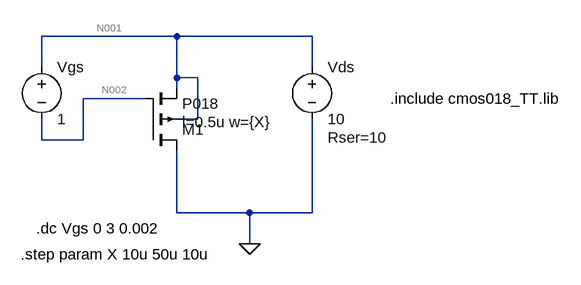
[diagram p0: schematic P018_Char.asc]
P018_Char.asc, the LTspice schematic file:
Version 4
SHEET 1 880 680
WIRE 208 80 0 80
WIRE 416 80 208 80
WIRE 0 128 0 80
WIRE 416 128 416 80
WIRE 208 144 208 80
WIRE 240 144 208 144
WIRE 208 160 208 144
WIRE 160 176 64 176
WIRE 240 208 240 144
WIRE 240 208 208 208
WIRE 0 240 0 208
WIRE 64 240 64 176
WIRE 64 240 0 240
WIRE 208 352 208 256
WIRE 320 352 208 352
WIRE 416 352 416 208
WIRE 416 352 320 352
WIRE 320 400 320 352
FLAG 320 400 0
SYMBOL voltage 0 112 R0
WINDOW 123 0 0 Left 0
WINDOW 39 0 0 Left 0
SYMATTR InstName Vgs
SYMATTR Value 1
SYMBOL voltage 416 112 R0
WINDOW 123 0 0 Left 0
WINDOW 39 24 124 Left 2
SYMATTR SpiceLine Rser=10
SYMATTR InstName Vds
SYMATTR Value 10
SYMBOL pmos4 160 256 M180
WINDOW 123 56 44 Left 2
SYMATTR InstName M1
SYMATTR Value P018
SYMATTR Value2 l=0.5u w={X}
TEXT 536 176 Left 2 !.include cmos018_TT.lib
TEXT -8 376 Left 2 !.dc Vgs 0 3 0.002
TEXT -32 416 Left 2 !.step param X 10u 50u 10u

The netlist it stands for:
* P018_Char.asc
Vgs N001 N002 1
Vds N001 0 10 Rser=10
M1 0 N002 N001 N001 P018 l=0.5u w={X}
.model NMOS NMOS
.model PMOS PMOS
.lib standard.mos
.include cmos018_TT.lib
.dc Vgs 0 3 0.002
.step param X 10u 50u 10u
.backanno
.end

* Results of the author's LTspice run, read from the files saved beside the schematic
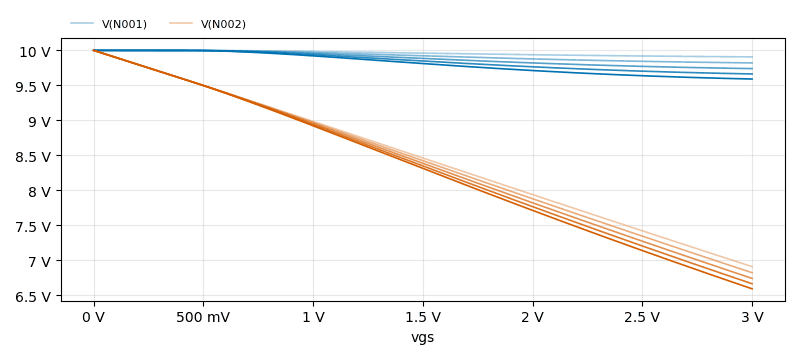
[diagram p1: DC transfer characteristic of P018_Char.asc, plotted from the saved traces]
* DC transfer characteristic, 5 runs:
*   V(N001) [x=1e-005]: 10 V at vgs=0 V, 9.907 V at vgs=3 V, min 9.907 V, max 10 V
*   V(N001) [x=2e-005]: 10 V at vgs=0 V, 9.82 V at vgs=3 V, min 9.82 V, max 10 V
*   V(N001) [x=3e-005]: 10 V at vgs=0 V, 9.739 V at vgs=3 V, min 9.739 V, max 10 V
*   V(N001) [x=4e-005]: 10 V at vgs=0 V, 9.663 V at vgs=3 V, min 9.663 V, max 10 V
*   V(N001) [x=5e-005]: 10 V at vgs=0 V, 9.59 V at vgs=3 V, min 9.59 V, max 10 V
*   V(N002) [x=1e-005]: 10 V at vgs=0 V, 6.907 V at vgs=3 V, min 6.907 V, max 10 V
*   V(N002) [x=2e-005]: 10 V at vgs=0 V, 6.82 V at vgs=3 V, min 6.82 V, max 10 V
*   V(N002) [x=3e-005]: 10 V at vgs=0 V, 6.739 V at vgs=3 V, min 6.739 V, max 10 V
*   V(N002) [x=4e-005]: 10 V at vgs=0 V, 6.663 V at vgs=3 V, min 6.663 V, max 10 V
*   V(N002) [x=5e-005]: 10 V at vgs=0 V, 6.59 V at vgs=3 V, min 6.59 V, max 10 V